# EAGLE design Thermocouple (EAGLE 6.2)
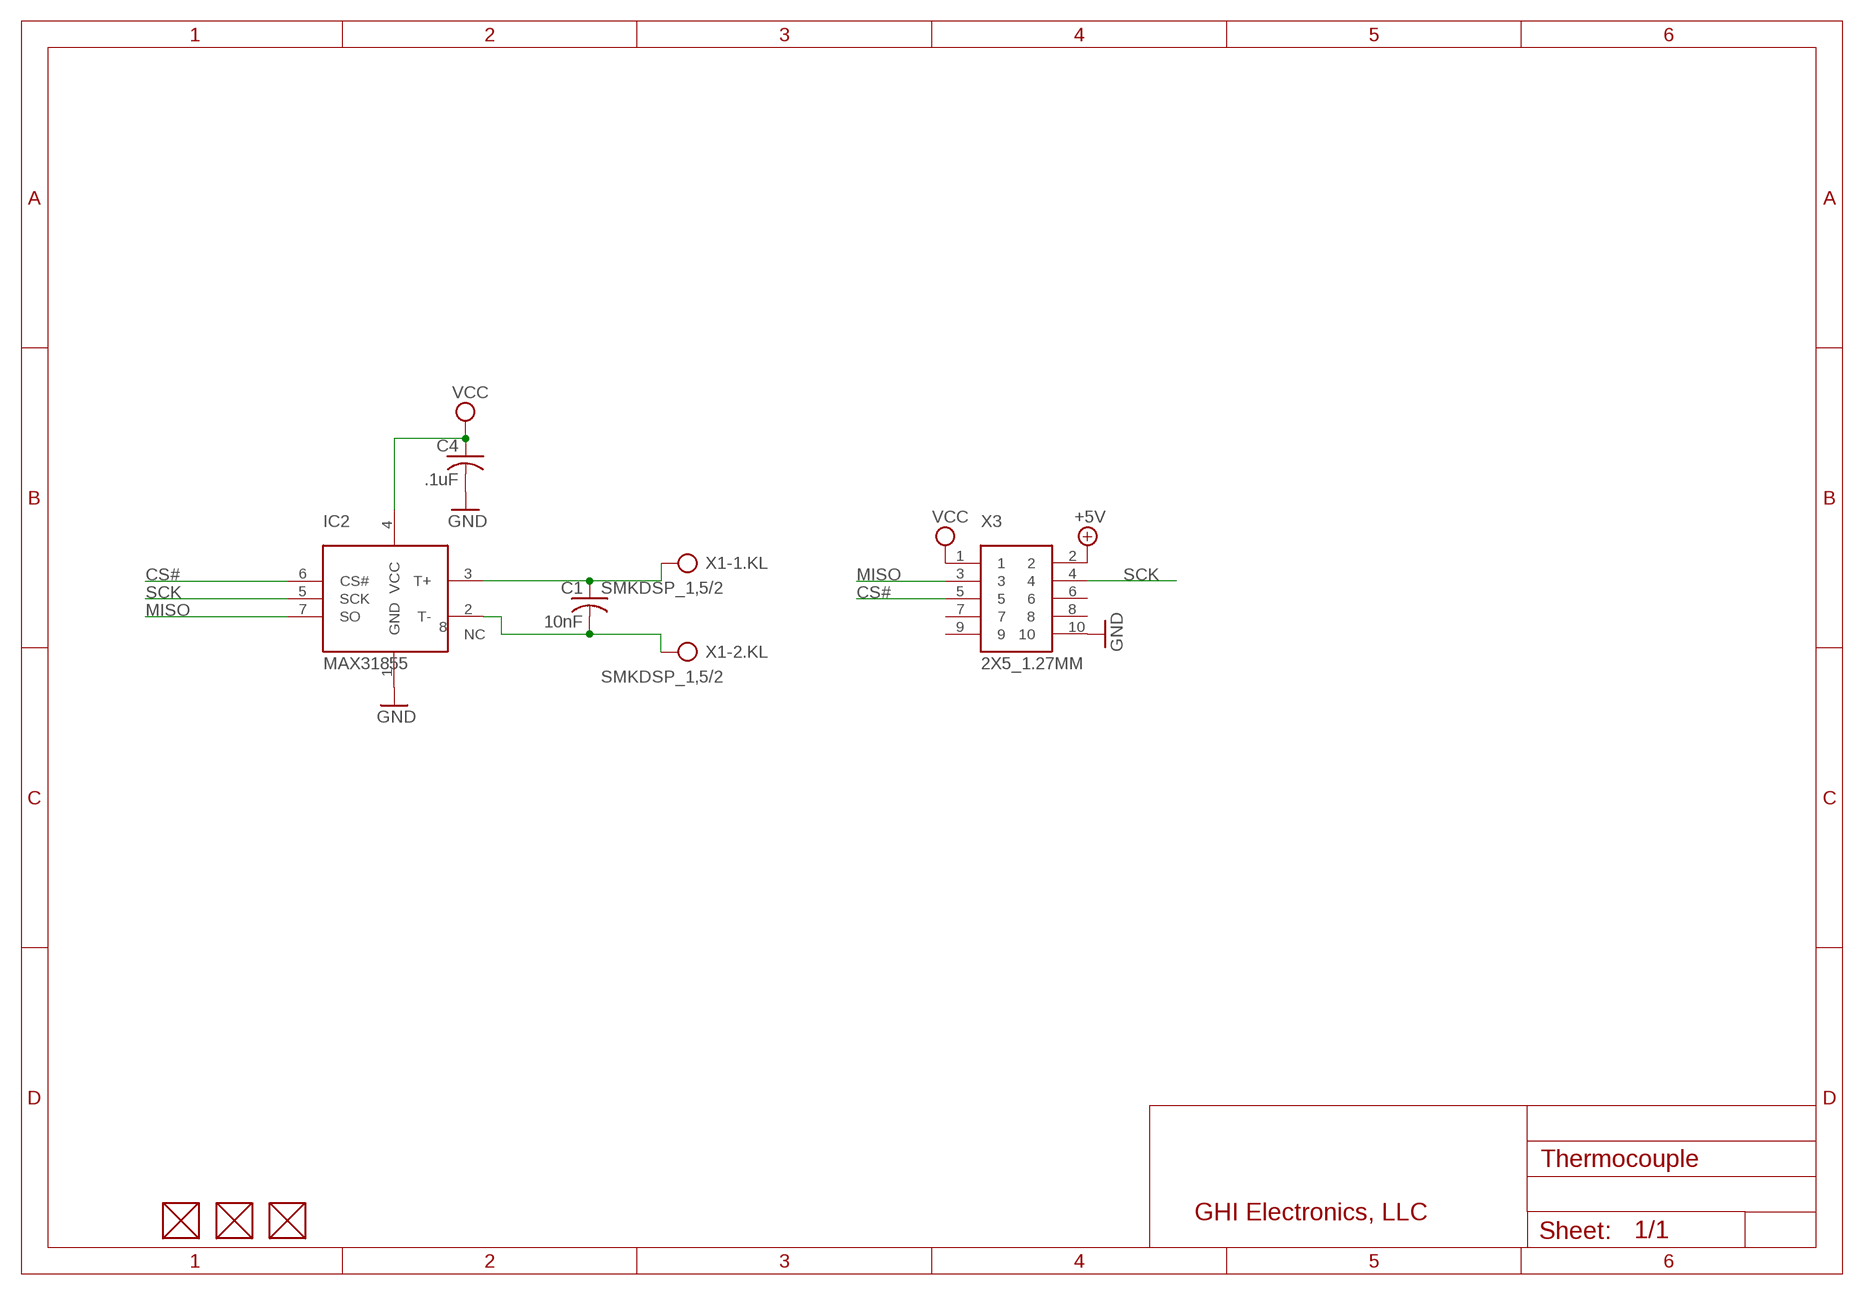
[diagram p0: schematic, sheet 1]

## Parts
C1  10nF  C-USC0603K  [C0603K]
C4  .1uF  C-USC0603K  [C0603K]
FUD1  FIDUCIAL  [FIDUCIAL_40MIL]
FUD2  FIDUCIAL  [FIDUCIAL_40MIL]
FUD3  FIDUCIAL  [FIDUCIAL_40MIL]
IC2  MAX31855  MAX6675  [SO8]
X1  SMKDSP_1,5/2  [SMKDSP_1,5/2]
X3  2X5_1.27MM  [2X5_1.27MM]

## Nets
+5V [power]: X3.2
CS#: IC2.6(CS#) X3.5
GND: C4.2 IC2.1(GND) X3.10
MISO: IC2.7(SO) X3.3
N$1: C1.1 IC2.3(T+) X1.1
N$2: C1.2 IC2.2(T-) X1.2
SCK: IC2.5(SCK) X3.4
VCC: C4.1 IC2.4(VCC) X3.1
Unconnected: FUD1.P$1 FUD2.P$1 FUD3.P$1 IC2.8(NC) X3.6 X3.7 X3.8 X3.9

## Notes on the sheet
- GHI Electronics, LLC

## Library data of the parts
C1 C4 = rcl:C-US: CAPACITOR, American symbol
FUD1-FUD3 = GHI:FIDUCIAL
IC2 = GHI:MAX6675
X1 = GHI2:SMKDSP_1,5/2: For Blue Wire Connector Block
X3 = GHI:2X5_1.27MM

## Board
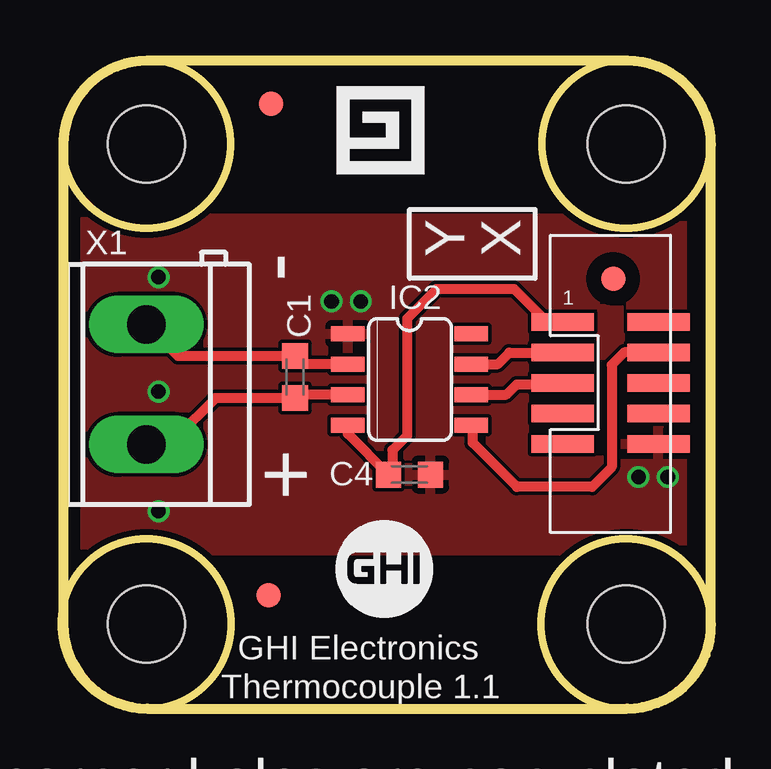
[diagram p1: board, top side]
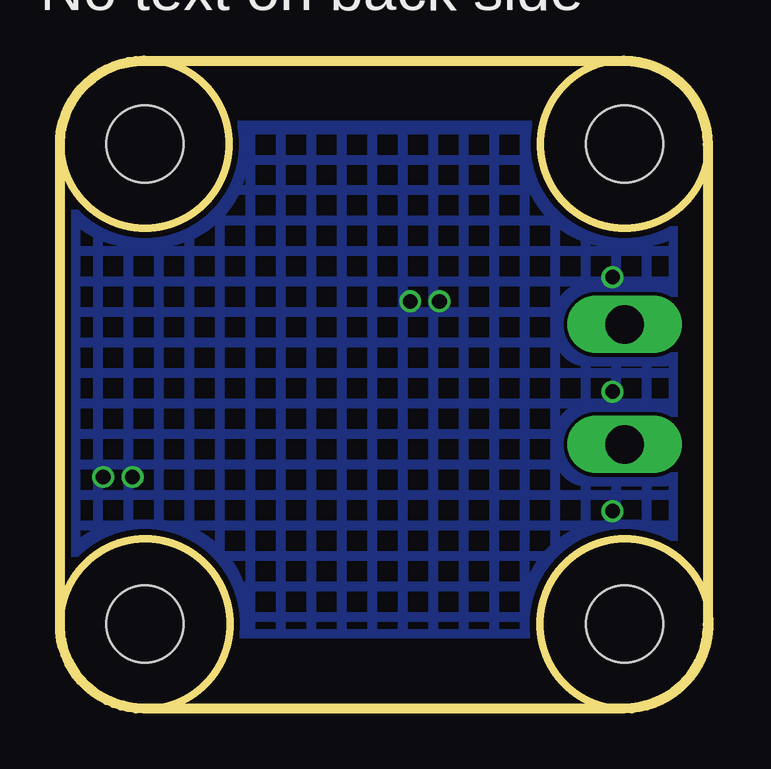
[diagram p2: board, bottom side, seen from below]

Size 27.08 x 27.04 mm. Coordinates in mm from the lower left corner, seen from the top.
Outline: 23.58,0.01 arc90 27.08,3.51 27.08,23.51 arc90 23.58,27.01 3.58,27.01 arc90 0.08,23.51 0.08,3.51 arc90 3.58,0.01 23.58,0.01
Outline: circle at 3.54,23.54 radius 3.5
Outline: circle at 23.54,23.54 radius 3.5
Outline: circle at 23.54,3.54 radius 3.54
Outline: circle at 3.54,3.54 radius 3.54
Copper layers (1+16): Top 0.035mm / dielectric 1.5mm / Bottom 0.035mm
Design rules: minimum track width 6mil, minimum drill 12mil, track to track 6mil, track to pad 6mil, pad to pad 6mil, via to via 6mil, smd to smd 0mil, copper to edge 10mil, drill to drill 10mil, minimum pad ring 10mil, minimum via ring 6mil, stop-mask expansion 2mil, vias tented up to drill 100mil, thermal gap 10mil
Holes 3.2 mm at 3.54,3.54 23.54,23.54 3.54,23.54 23.54,3.54

### Footprints (pad centres in the part's own frame; a part is rotated, then mirrored left to right if it is on the bottom)
C0603K = smd 1.05 x 1.08: 1 -0.875,0; 2 0.875,0
FIDUCIAL_40MIL = smd 1.016 x 1.016: P$1 0,0
SO8 = smd 0.635 x 1.397: 1 -1.905,-2.565; 2 -0.635,-2.565; 3 0.635,-2.565; 4 1.905,-2.565; 5 1.905,2.565; 6 0.635,2.565; 7 -0.635,2.565; 8 -1.905,2.565
SMKDSP_1,5/2 = drill 1.6 pad 1.8 long: 1 -2.5,0; 2 2.5,0
2X5_1.27MM = smd 2.6 x 0.74: 1 -2,2.58; 2 2,2.58; 3 -2,1.31; 4 2,1.31; 5 -2,0.04; 6 2,0.04; 7 -2,-1.23; 8 2,-1.23; 9 -2,-2.5; 10 2,-2.5

### Placement (x,y rotation side)
C1  9.73,13.83 90 top
C4  14.51,9.76 0 top
FUD1  8.64,4.74 0 top
FUD2  8.74,25.2 0 top
FUD3  23,17.92 0 top
IC2  14.51,13.72 270 top
X1  3.53,13.52 90 top
X3  22.89,13.54 0 top

### Tracks (layer width: path | path; a pad name or v marks a point on that pad's centre or on a via)
CS#
  Top 0.406: IC2.6 18.55,13.09 18.98,13.52 20.83,13.52 X3.5
GND  (via drill 0.61)
  other vias: 4.04,17.99 4.04,13.22 4.04,8.24 24.06,9.66 25.28,9.66 11.26,16.98 12.48,16.98
  pour Top: 0.99,20.43 0.99,6.61 25.89,6.61 25.89,20.43
  pour Bottom (hatched): 26.5,24.29 26.5,3.16 1.5,3.16 1.5,24.29
MISO
  Top 0.406: IC2.7 18.19,14.36 18.67,14.84 X3.3
N$1
  Top 0.406: IC2.3 9.87,13.09 C1.1 6.42,12.95 4.75,11.29 3.8,11.29 X1.1
N$2
  Top 0.406: IC2.2 10.07,14.36 C1.2 4.85,14.7 X1.2
SCK
  Top 0.406: X3.4 23.46,14.85 22.94,14.33 22.94,10.07 22.13,9.25 18.98,9.25 17.15,11.08 17.15,11.74 IC2.5
VCC
  Top 0.406: IC2.4 11.94,11.45 C4.1 13.8,9.93 13.8,10.78 14.41,11.39 14.41,16.26 15.62,17.48 18.88,17.48 20.24,16.12 X3.1

### Text on the board
tPlace: - | Y | X | + | GHI Electronics | Thermocouple 1.1 | corner holes are non-plated | Black PCB with white print | Do not add any manufacturing Code!
bPlace: No text on back side